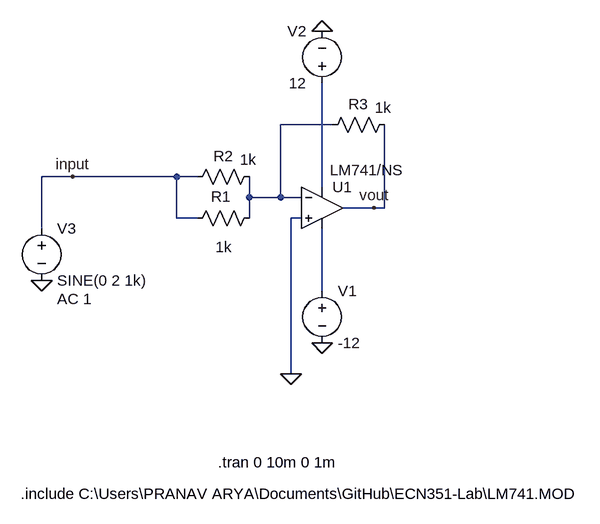
[diagram p0: schematic Adder.asc]
Adder.asc, the LTspice schematic file:
Version 4
SHEET 1 880 680
WIRE 288 -208 208 -208
WIRE -112 -128 -160 -128
WIRE 48 -128 -112 -128
WIRE 80 -128 48 -128
WIRE 272 -112 272 -272
WIRE 160 -96 160 -128
WIRE 208 -96 208 -208
WIRE 208 -96 160 -96
WIRE 240 -96 208 -96
WIRE 352 -80 304 -80
WIRE 368 -80 368 -208
WIRE 368 -80 352 -80
WIRE 48 -64 48 -128
WIRE 80 -64 48 -64
WIRE 160 -64 160 -96
WIRE 240 -64 224 -64
WIRE -160 -48 -160 -128
WIRE 272 48 272 -48
WIRE 224 176 224 -64
FLAG 272 128 0
FLAG 272 -352 0
FLAG -160 32 0
FLAG 224 176 0
FLAG 352 -80 vout
FLAG -112 -128 input
SYMBOL OpAmps\\opamp2 272 -144 R0
WINDOW 3 12 6 Left 2
SYMATTR Value LM741/NS
SYMATTR InstName U1
SYMBOL voltage 272 32 R0
WINDOW 123 0 0 Left 0
WINDOW 39 0 0 Left 0
SYMATTR InstName V1
SYMATTR Value -12
SYMBOL voltage 272 -256 R180
WINDOW 0 24 96 Left 2
WINDOW 3 24 16 Left 2
WINDOW 123 0 0 Left 0
WINDOW 39 0 0 Left 0
SYMATTR InstName V2
SYMATTR Value 12
SYMBOL res 176 -80 R90
WINDOW 0 -2 60 VBottom 2
WINDOW 3 45 55 VTop 2
SYMATTR InstName R1
SYMATTR Value 1k
SYMBOL res 176 -144 R90
WINDOW 0 0 56 VBottom 2
WINDOW 3 -26 18 VTop 2
SYMATTR InstName R2
SYMATTR Value 1k
SYMBOL voltage -160 -64 R0
WINDOW 123 24 124 Left 2
WINDOW 39 0 0 Left 0
SYMATTR Value2 AC 1
SYMATTR InstName V3
SYMATTR Value SINE(0 2 1k)
SYMBOL res 384 -224 R90
WINDOW 0 0 56 VBottom 2
WINDOW 3 -26 18 VTop 2
SYMATTR InstName R3
SYMATTR Value 1k
TEXT -192 360 Left 2 !.include C:\\Users\\PRANAV ARYA\\Documents\\GitHub\\ECN351-Lab\\LM741.MOD
TEXT 112 312 Left 2 !.tran 0 10m 0 1m

The netlist it stands for:
* Adder.asc
XU1 0 N001 N002 N003 vout LM741/NS  ; pins In+ In- V+ V- OUT
V1 N003 0 -12
V2 N002 0 12
R1 N001 input 1k
R2 N001 input 1k
V3 input 0 SINE(0 2 1k) AC 1
R3 vout N001 1k
.include C:\Users\PRANAV ARYA\Documents\GitHub\ECN351-Lab\LM741.MOD
.tran 0 10m 0 1m
.backanno
.end